# Altium schematic sheet E17-PDU-PROCESSOR.SchDoc
size A4
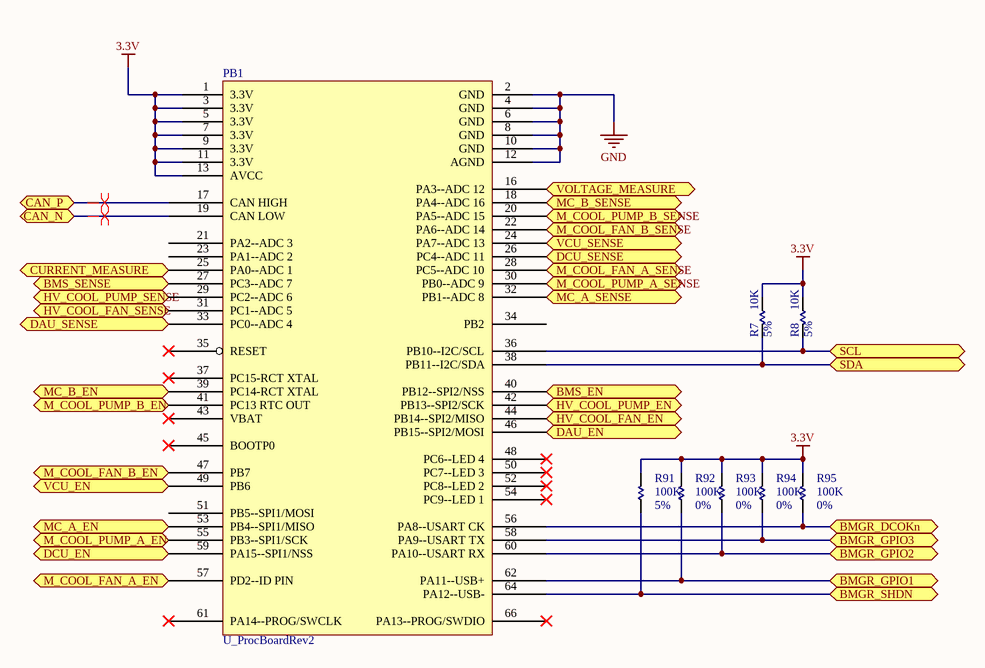
[diagram p0: E17-PDU-PROCESSOR.SchDoc]

## Parts
PB1  U_ProcBoardRev2  [PROC_BOARD]
R7  value 10K  Tolerance: 5%  [R0603]  (hidden comment: R_0603_Generic)
R8  value 10K  Tolerance: 5%  [R0603]  (hidden comment: R_0603_Generic)
R91  value 100K  Tolerance: 5%  [R0603]  (hidden comment: R_0603_Generic)
R92  value 100K  Tolerance: 0%  [R0603]  (hidden comment: R_0603_Generic)
R93  value 100K  Tolerance: 0%  [R0603]  (hidden comment: R_0603_Generic)
R94  value 100K  Tolerance: 0%  [R0603]  (hidden comment: R_0603_Generic)
R95  value 100K  Tolerance: 0%  [R0603]  (hidden comment: R_0603_Generic)

## Ports
BMGR_DCOKn, BMGR_GPIO1, BMGR_GPIO2, BMGR_GPIO3, BMGR_SHDN, BMS_EN, BMS_SENSE, CAN_N, CAN_P, CURRENT_MEASURE, DAU_EN, DAU_SENSE, DCU_EN, DCU_SENSE, HV_COOL_FAN_EN, HV_COOL_FAN_SENSE, HV_COOL_PUMP_EN, HV_COOL_PUMP_SENSE, M_COOL_FAN_A_EN, M_COOL_FAN_A_SENSE, M_COOL_FAN_B_EN, M_COOL_FAN_B_SENSE, M_COOL_PUMP_A_EN, M_COOL_PUMP_A_SENSE, M_COOL_PUMP_B_EN, M_COOL_PUMP_B_SENSE, MC_A_EN, MC_A_SENSE, MC_B_EN, MC_B_SENSE, SCL, SDA, VCU_EN, VCU_SENSE, VOLTAGE_MEASURE

## Nets
3.3V: PB1.1(3.3V) PB1.3(3.3V) PB1.5(3.3V) PB1.7(3.3V) PB1.9(3.3V) PB1.11(3.3V) PB1.13(AVCC) R7.2 R8.2 R91.1 R92.1 R93.1 R94.1 R95.1
GND: PB1.2(GND) PB1.4(GND) PB1.6(GND) PB1.8(GND) PB1.10(GND) PB1.12(AGND)
BMGR_DCOKn: PB1.56(PA8--USART_CK) R95.2 ; port BMGR_DCOKn
BMGR_GPIO1: PB1.62(PA11--USB+) R92.2 ; port BMGR_GPIO1
BMGR_GPIO2: PB1.60(PA10--USART_RX) R93.2 ; port BMGR_GPIO2
BMGR_GPIO3: PB1.58(PA9--USART_TX) R94.2 ; port BMGR_GPIO3
BMGR_SHDN: PB1.64(PA12--USB-) R91.2 ; port BMGR_SHDN
BMS_EN: PB1.40(PB12--SPI2/NSS) ; port BMS_EN
BMS_SENSE: PB1.27(PC3--ADC_7) ; port BMS_SENSE
CAN_N: PB1.19(CAN_LOW) ; port CAN_N
CAN_P: PB1.17(CAN_HIGH) ; port CAN_P
CURRENT_MEASURE: PB1.25(PA0--ADC_1) ; port CURRENT_MEASURE
DAU_EN: PB1.46(PB15--SPI2/MOSI) ; port DAU_EN
DAU_SENSE: PB1.33(PC0--ADC_4) ; port DAU_SENSE
DCU_EN: PB1.59(PA15--SPI1/NSS) ; port DCU_EN
DCU_SENSE: PB1.26(PC4--ADC_11) ; port DCU_SENSE
HV_COOL_FAN_EN: PB1.44(PB14--SPI2/MISO) ; port HV_COOL_FAN_EN
HV_COOL_FAN_SENSE: PB1.31(PC1--ADC_5) ; port HV_COOL_FAN_SENSE
HV_COOL_PUMP_EN: PB1.42(PB13--SPI2/SCK) ; port HV_COOL_PUMP_EN
HV_COOL_PUMP_SENSE: PB1.29(PC2--ADC_6) ; port HV_COOL_PUMP_SENSE
M_COOL_FAN_A_EN: PB1.57(PD2--ID_PIN) ; port M_COOL_FAN_A_EN
M_COOL_FAN_A_SENSE: PB1.28(PC5--ADC_10) ; port M_COOL_FAN_A_SENSE
M_COOL_FAN_B_EN: PB1.47(PB7) ; port M_COOL_FAN_B_EN
M_COOL_FAN_B_SENSE: PB1.22(PA6--ADC_14) ; port M_COOL_FAN_B_SENSE
M_COOL_PUMP_A_EN: PB1.55(PB3--SPI1/SCK) ; port M_COOL_PUMP_A_EN
M_COOL_PUMP_A_SENSE: PB1.30(PB0--ADC_9) ; port M_COOL_PUMP_A_SENSE
M_COOL_PUMP_B_EN: PB1.41(PC13_RTC_OUT) ; port M_COOL_PUMP_B_EN
M_COOL_PUMP_B_SENSE: PB1.20(PA5--ADC_15) ; port M_COOL_PUMP_B_SENSE
MC_A_EN: PB1.53(PB4--SPI1/MISO) ; port MC_A_EN
MC_A_SENSE: PB1.32(PB1--ADC_8) ; port MC_A_SENSE
MC_B_EN: PB1.39(PC14-RCT_XTAL) ; port MC_B_EN
MC_B_SENSE: PB1.18(PA4--ADC_16) ; port MC_B_SENSE
SCL: PB1.36(PB10--I2C/SCL) R8.1 ; port SCL
SDA: PB1.38(PB11--I2C/SDA) R7.1 ; port SDA
VCU_EN: PB1.49(PB6) ; port VCU_EN
VCU_SENSE: PB1.24(PA7--ADC_13) ; port VCU_SENSE
VOLTAGE_MEASURE: PB1.16(PA3--ADC_12) ; port VOLTAGE_MEASURE

Not connected (* = marked no-connect by the designer): PB1 14(NC) 15(NC) 21(PA2--ADC_3) 23(PA1--ADC_2) 34(PB2) 35(RESET)* 37(PC15-RCT_XTAL)* 43(VBAT)* 45(BOOTP0)* 48(PC6--LED_4)* 50(PC7--LED_3)* 51(PB5--SPI1/MOSI) 52(PC8--LED_2)* 54(PC9--LED_1)* 61(PA14--PROG/SWCLK)* 63(NC) 65(NC) 66(PA13--PROG/SWDIO)* 67

## Layout directives
differential pair: CAN_N, CAN_P

## Library data of the parts
PB1 = U_ProcBoardRev2: Processor board that carries the STM32F072RB
R7 R8 = R_0603_Generic: Generic 0603 Resistor; Power: 1/10W; Supplier: Digikey; Supplier_PN: P10KGCT-ND
R91-R95 = R_0603_Generic: Generic 0603 Resistor; Power: 0W; Supplier: Digikey; Supplier_PN: 000-00-00-ND